# EAGLE design TempSensorBuddyV1 (EAGLE 9.2.2)
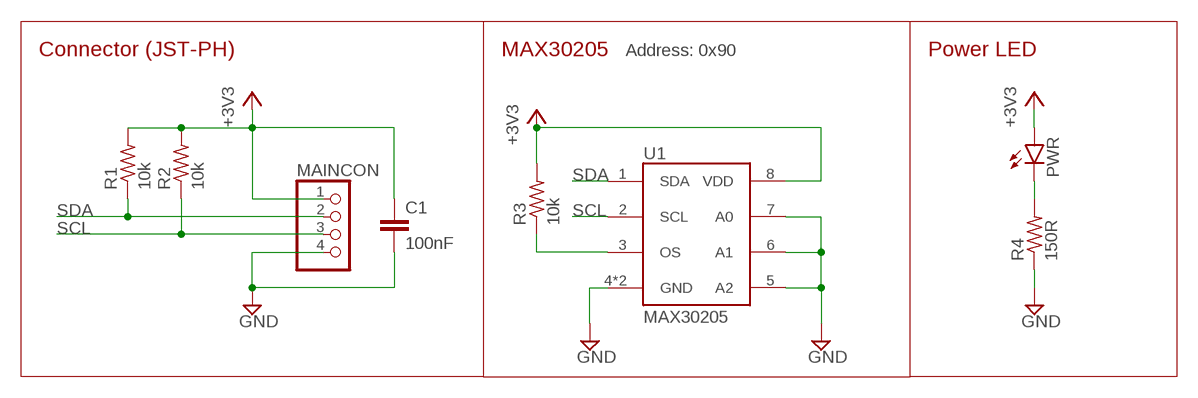
[diagram p0: schematic, sheet 1]

## Parts
C1  100nF  C-EUC0603  [C0603]
MAINCON  PINHD-1X4M  [1X04M]
PWR  LEDCHIPLED_0805  [CHIPLED_0805]
R1  10k  R-US_R0603  [R0603]
R2  10k  R-US_R0603  [R0603]
R3  10k  R-US_R0603  [R0603]
R4  150R  R-US_R0603  [R0603]
U1  MAX30205  [DFN-8]

## Nets
+3V3 [Power]: C1.1 MAINCON.1 PWR.A R1.2 R2.2 R3.2 U1.8(VDD)
GND [Power]: C1.2 MAINCON.4 R4.1 U1.4(GND) U1.5(A2) U1.6(A1) U1.7(A0) U1.9(GND)
N$1: R3.1 U1.3(OS)
N$3: PWR.C R4.2
SCL: MAINCON.3 R2.1 U1.2(SCL)
SDA: MAINCON.2 R1.1 U1.1(SDA)

## Notes on the sheet
- Connector (JST-PH) | MAX30205 | Address: 0x90 | Power LED

## Library data of the parts
C1 = rcl:C-EU: CAPACITOR, European symbol; SPICEPREFIX: C
MAINCON = pinhead2:PINHD-1X4: PIN HEADER
PWR = led:LED: LED OSRAM: - CHIPLED LG R971, LG N971, LY N971, LG Q971, LY Q971, LO R971, LY R971 LH N974, LH R974 LS Q976, LO Q976, LY Q976 LO Q996 - Hyper CHIPLED LW Q18S LB Q993, LB Q99A, LB R99A - SideLED LS A670, LO A670, LY A670, LG A670, LP A670 LB A673, LV A673, LT A673, LW A673 LH A674 LY A675 LS A676, LA A676, LO A676, LY A676, LW A676 LS A679, LY A679, LG A679 - Hyper Micro SIDELED® LS Y876, LA Y876, LO Y876, LY Y876 LT Y87S - SmartLED LW L88C, LW L88S LB L89C, LB L89S, LG L890 LS L89K, LO L89K, LY L89K LS L896, LA L896, LO L896, LY L896 - TOPLED LS T670, LO T670, LY T670, LG T670, LP T670 LSG T670, LSP T670, LSY T670, LOP T670, LYG T670 LG T671, LOG T671, LSG T671 LB T673, LV T673, LT T673, LW T673 LH T674 LS T676, LA T676, LO T676, LY T676, LB T676, LH T676, LSB T676, LW T676 LB T67C, LV T67C, LT T67C, LS T67K, LO T67K, LY T67K, LW E67C LS E67B, LA E67B, LO E67B, LY E67B, LB E67C, LV E67C, LT E67C LW T67C LS T679, LY T679, LG T679 LS T770, LO T770, LY T770, LG T770, LP T770 LB T773, LV T773, LT T773, LW T773 LH T774 LS E675, LA E675, LY E675, LS T675 LS T776, LA T776, LO T776, LY T776, LB T776 LHGB T686 LT T68C, LB T68C - Hyper Mini TOPLED® LB M676 - Mini TOPLED Santana® LG M470 LS M47K, LO M47K, LY M47K Source: http://www.osram.convergy.de LUXEON: - LUMILED® LXK2-PW12-R00, LXK2-PW12-S00, LXK2-PW14-U00, LXK2-PW14-V00 LXK2-PM12-R00, LXK2-PM12-S00, LXK2-PM14-U00 LXK2-PE12-Q00, LXK2-PE12-R00, LXK2-PE12-S00, LXK2-PE14-T00, LXK2-PE14-U00 LXK2-PB12-K00, LXK2-PB12-L00, LXK2-PB12-M00, LXK2-PB14-N00, LXK2-PB14-P00, LXK2-PB14-Q00 LXK2-PR12-L00, LXK2-PR12-M00, LXK2-PR14-Q00, LXK2-PR14-R00 LXK2-PD12-Q00, LXK2-PD12-R00, LXK2-PD12-S00 LXK2-PH12-R00, LXK2-PH12-S00 LXK2-PL12-P00, LXK2-PL12-Q00, LXK2-PL12-R00 Source: www.luxeon.com KINGBRIGHT: KA-3528ASYC Source: www.kingbright.com
R1-R4 = rcl:R-US_: RESISTOR, American symbol; SPICEPREFIX: R
U1 = Custom Parts:MAX30205

## Board
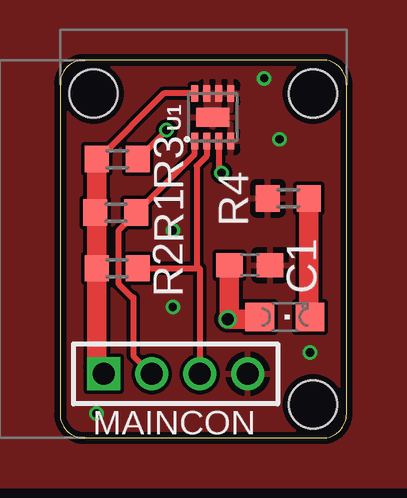
[diagram p1: board, top side]
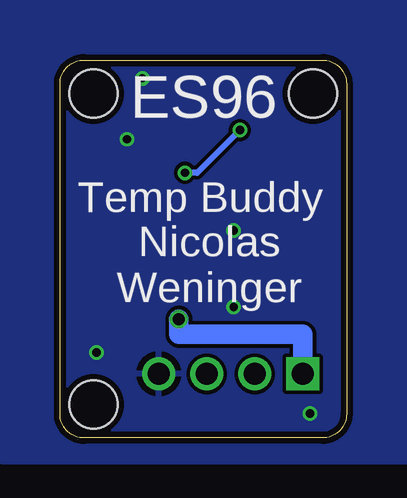
[diagram p2: board, bottom side, seen from below]

Size 11.94 x 15.75 mm. Coordinates in mm from the lower left corner, seen from the top.
Outline: 0,14.75 0,1 arc90 1,0 10.94,0 arc90 11.94,1 11.94,14.75 arc90 10.94,15.75 1,15.75 arc90 0,14.75
Copper layers (1*16): Top 0.035559375mm / dielectric 1.6mm / Bottom 0.035559375mm
Design rules "Custom": minimum track width 6mil, minimum drill 10mil, track to track 6mil, track to pad 6mil, pad to pad 6mil, via to via 6mil, smd to smd 6mil, copper to edge 10mil, drill to drill 6mil, minimum pad ring 5mil, minimum via ring 5mil, stop-mask expansion 2.5mil, vias tented up to drill 15mil, thermal gap 10mil
Holes 2 mm at 10.54,14.35 1.4,14.35 10.54,1.4

### Footprints (pad centres in the part's own frame; a part is rotated, then mirrored left to right if it is on the bottom)
C0603 = smd 1.1 x 1: 1 -0.85,0; 2 0.85,0
1X04M = drill 0.914 square: 1 -3,0 | drill 0.914: 2 -1,0; 3 1,0; 4 3,0
CHIPLED_0805 = smd 1.2 x 1.2: A 0,-1.05; C 0,1.05
R0603 = smd 1 x 1.1: 1 -0.85,0; 2 0.85,0
DFN-8 = smd 0.3 x 0.7: 1 -0.75,-0.99; 2 -0.25,-0.99; 3 0.25,-0.99; 4 0.75,-0.99; 5 0.75,0.99; 6 0.25,0.99; 7 -0.25,0.99; 8 -0.75,0.99 | smd 1.38 x 0.8: 9 0,0

### Placement (x,y rotation side)
C1  7.9,7.2 0 top
MAINCON  4.82,2.67 0 top
PWR  9.37,5.04 270 top
R1  2.33,9.39 180 top
R2  2.38,7.07 180 top
R3  2.39,11.62 180 top
R4  9.51,9.98 0 top
U1  6.36,13.37 0 top

### Tracks (layer width: path | path; a pad name or v marks a point on that pad's centre or on a via)
+3V3  (via drill 0.5)
  Top 0.254: U1.8 4.32,14.36 1.59,11.62 R3.2
  Top 0.813: C1.1 7.06,4.95 | 7.06,4.95 v6.99,4.95 | R1.2 1.53,9.39 R2.2 | R2.2 R3.2 | R2.2 1.53,2.96 MAINCON.1 | PWR.A 8.23,4.95 7.06,4.95
  Bottom 0.813: v6.99,4.95 6.99,4.32 1.91,4.32 1.82,4.32 MAINCON.1
GND  (via drill 0.35)
  other vias: 9.14,12.45 4.7,8.64 4.7,5.46 1.52,1.02 8.51,14.99 10.41,3.56
  pour Bottom: -2.63,20.97 14.37,20.97 14.37,-1.03 -2.63,-1.03
  pour Top: -3.63,21.97 15.37,21.97 15.37,-2.03 -3.63,-2.03
N$1  (via drill 0.35)
  Top 0.254: R3.1 v4.45,12.82 v4.45,12.83 | U1.3 6.61,11.17 v6.73,11.05
  Bottom 0.254: v4.45,12.83 6.22,11.05 v6.73,11.05
N$3
  Top 0.813: R4.2 10.36,5.1 PWR.C
SCL
  Top 0.254: U1.2 6.11,11.74 5.7,11.32 5.7,7.07 | R2.1 5.44,7.07 5.7,7.07 | 5.7,7.07 5.82,7.07 MAINCON.3
SDA
  Top 0.254: MAINCON.2 3.06,3.43 3.06,5.86 3,5.86 2.45,6.4 2.45,8.66 R1.1 5.61,11.82 U1.1

### Text on the board
bPlace: ES96 | Temp Buddy | Nicolas / Weninger